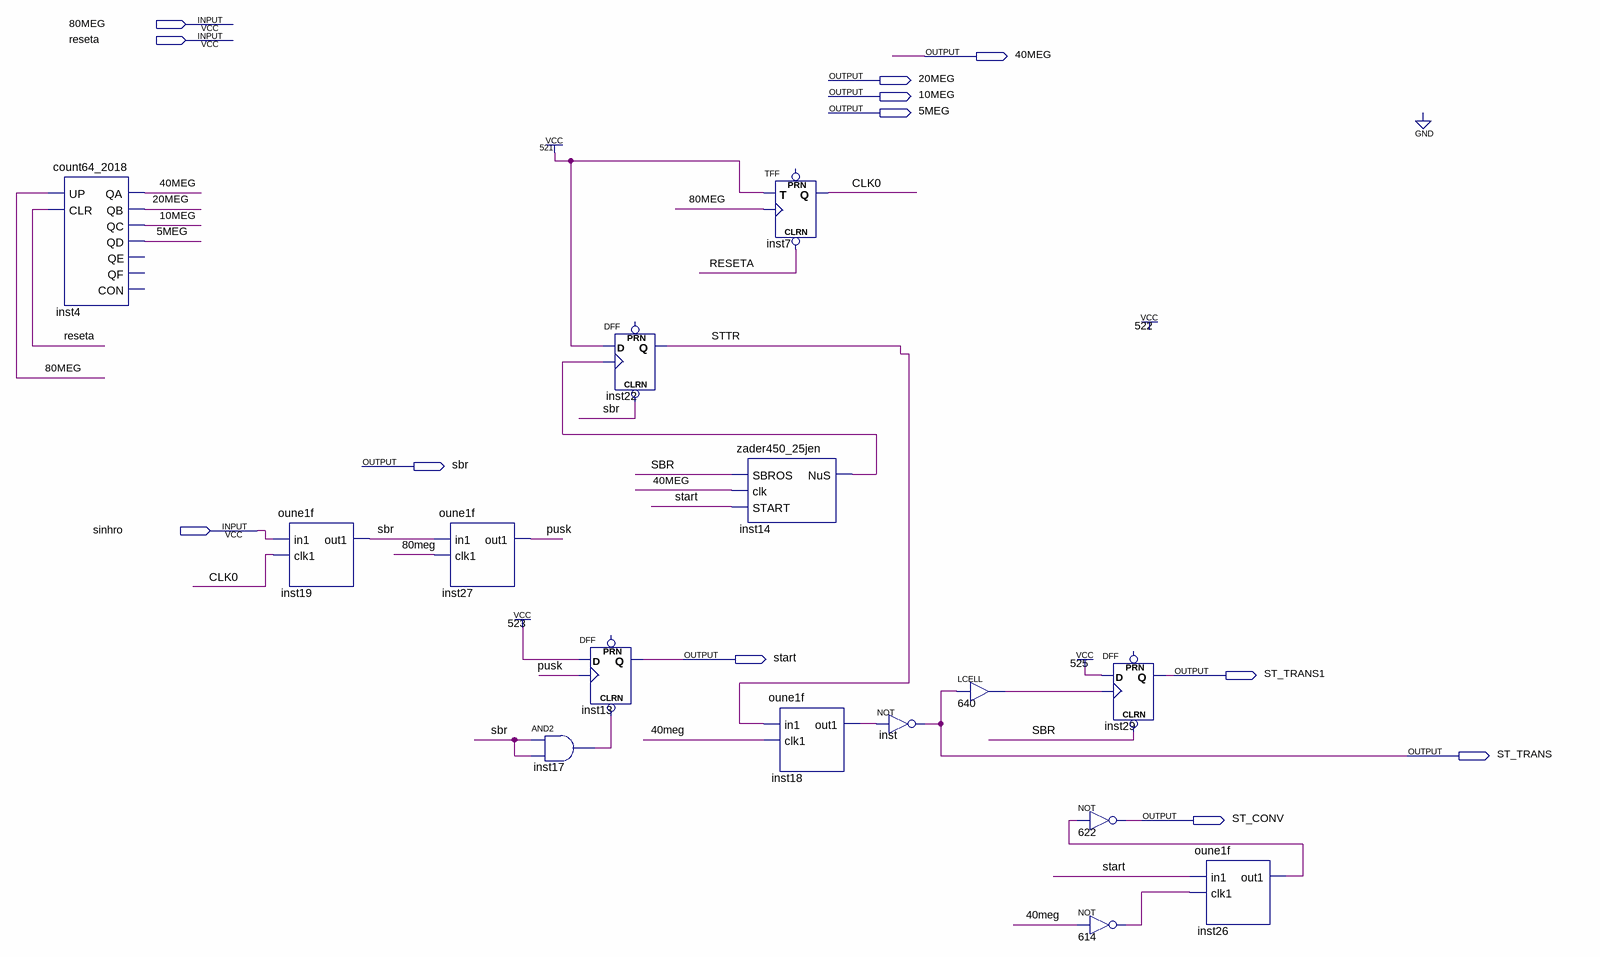
[diagram p0: schematic sheet]
// Quartus schematic upradcCDI64500_5des2.bdf as structural Verilog: 15 symbols, 12 pins
module upradcCDI64500_5des2 (
  input  \80MEG ,
  input  reseta,
  input  sinhro,
  output \40MEG ,
  output \20MEG ,
  output \10MEG ,
  output \5MEG ,
  output sbr,
  output start,
  output ST_TRANS1,
  output ST_TRANS,
  output ST_CONV
);

  wire CLK0, inst14_nus, inst17_out, inst18_out1, inst26_out1, n614_out, n640_out, pusk, STTR;

  count64_2018 inst4 (
    .UP(\80MEG ), .CLR(reseta), .QA(\40MEG ), .QB(\20MEG ), .QC(\10MEG ), .QD(\5MEG ));  // open: QE, QF, CON
  oune1f inst19 (.in1(sinhro), .clk1(CLK0), .out1(sbr));
  oune1f inst27 (.in1(sbr), .clk1(\80MEG ), .out1(pusk));
  DFF inst13 (.CLRN(inst17_out), .CLK(pusk), .D(1'b1), .Q(start));  // open: PRN
  and inst17 (inst17_out, sbr, sbr);
  DFF inst22 (.CLRN(sbr), .CLK(inst14_nus), .D(1'b1), .Q(STTR));  // open: PRN
  TFF inst7 (.CLRN(reseta), .T(1'b1), .CLK(\80MEG ), .Q(CLK0));  // open: PRN
  zader450_25jen inst14 (.SBROS(sbr), .clk(\40MEG ), .START(start), .NuS(inst14_nus));
  oune1f inst18 (.in1(STTR), .clk1(\40MEG ), .out1(inst18_out1));
  not inst (ST_TRANS, inst18_out1);
  LCELL u_640 (.IN(ST_TRANS), .OUT(n640_out));
  not u_622 (ST_CONV, inst26_out1);
  not u_614 (n614_out, \40MEG );
  DFF inst29 (.CLRN(sbr), .CLK(n640_out), .D(1'b1), .Q(ST_TRANS1));  // open: PRN
  oune1f inst26 (.in1(start), .clk1(n614_out), .out1(inst26_out1));
endmodule
